# Altium project Current_Sensing.PrjPcb
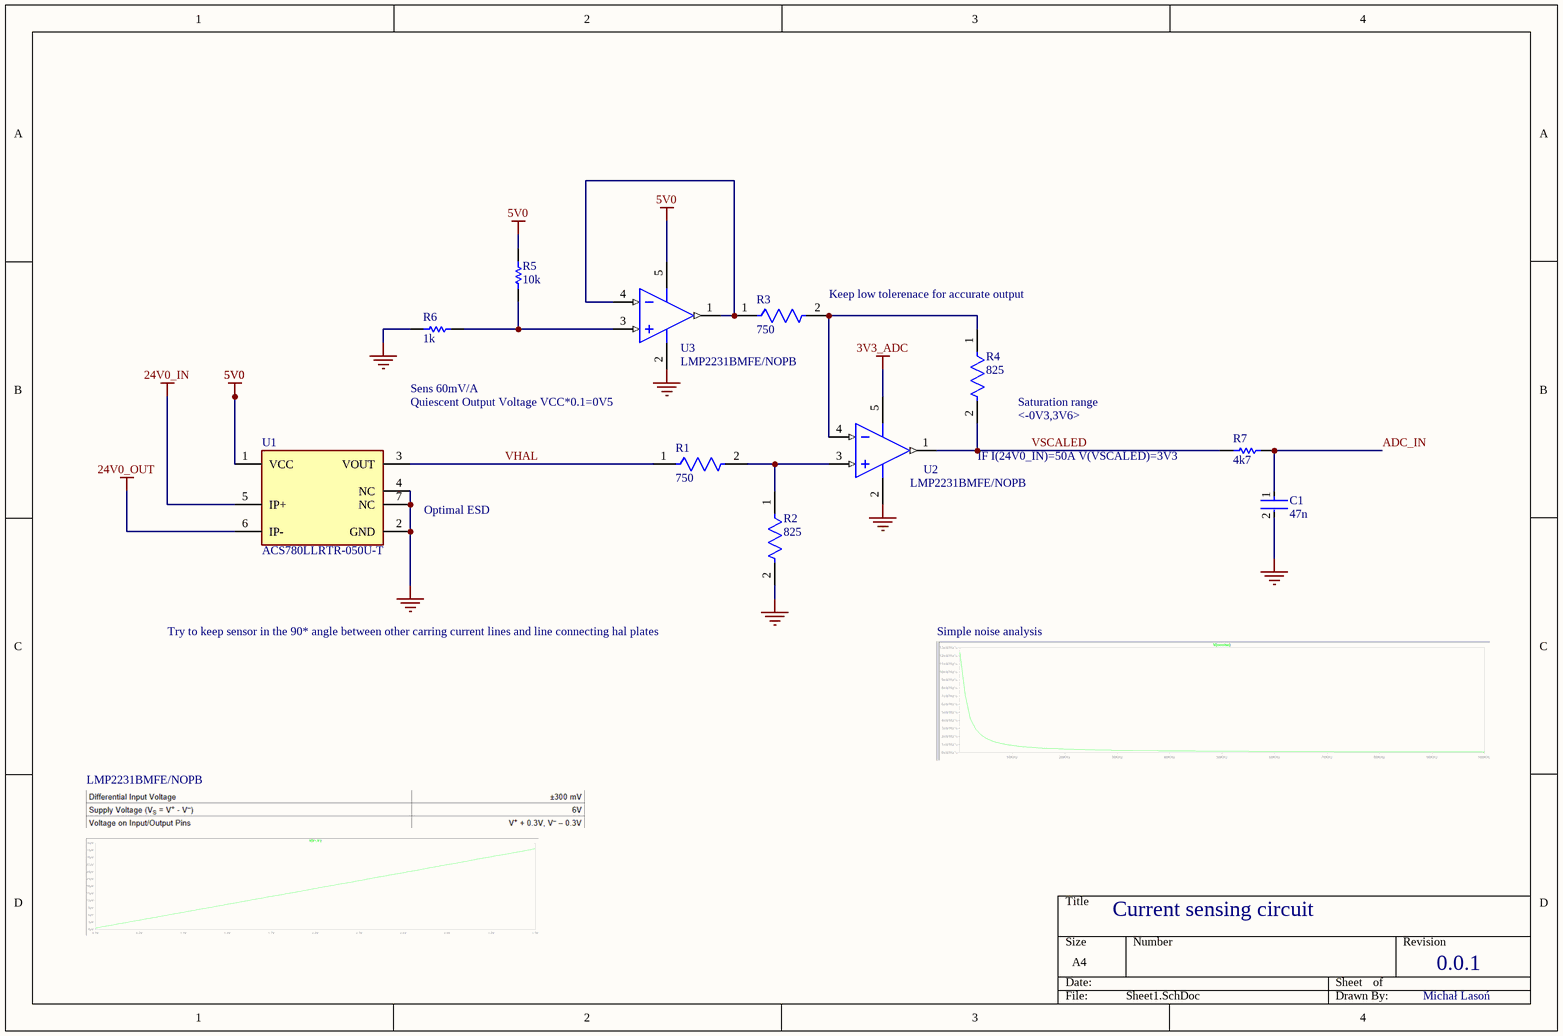
[diagram p0: Sheet1.SchDoc]
1 sheet, 11 parts. Net scope: global (net labels, ports and power ports of the same name join across sheets).

## Sheet Sheet1.SchDoc
size A4; SheetNumber: 1; SheetTotal: 1

### Parts
C1  47n  [FP-0805-L_2_01_0_2-W_1_25-MFG]
R1  750  [FP-RP73P-1J-MFG]
R2  825  [FP-RP73P-1J-MFG]
R3  750  [FP-RP73P-1J-MFG]
R4  825  [FP-RP73P-1J-MFG]
R5  10k  [RESC1609X50X30NL8T20]
R6  1k  [RESC1608X55X30LL15T15]
R7  4k7  [YAGO-RC0805_M]
U1  ACS780LLRTR-050U-T  [FP-LR-7-MFG]
U2  LMP2231BMFE/NOPB  [DBV0005A_L]
U3  LMP2231BMFE/NOPB  [DBV0005A_L]

### Nets
3V3_ADC: U2.5(V+)
5V0: R5.2 U1.1(VCC) U3.5(V+)
24V0_IN: U1.5(IP+)
24V0_OUT: U1.6(IP-)
GND: C1.2 R2.2 R6.1 U1.2(GND) U1.4(NC) U1.7(NC) U2.2(V-) U3.2(V-)
ADC_IN: C1.1 R7.2
VHAL: R1.1 U1.3(VOUT)
VSCALED: R4.2 R7.1 U2.1(OUT)
NetR1_2: R1.2 R2.1 U2.3(IN+)
NetR3_1: R3.1 U3.1(OUT) U3.4(IN-)
NetR3_2: R3.2 R4.1 U2.4(IN-)
NetR5_1: R5.1 R6.2 U3.3(IN+)

### Notes on the sheet
- (near R3) Keep low tolerenace for accurate output
- Sens 60mV/A
- Quiescent Output Voltage VCC*0.1=0V5
- (near R4) <-0V3,3V6>
- (near R4) Saturation range
- (near U1) Optimal ESD
- IF I(24V0_IN)=50A V(VSCALED)=3V3
- Try to keep sensor in the 90* angle between other carring current lines and line connecting hal plates
- Simple noise analysis
- LMP2231BMFE/NOPB
- Current sensing circuit
- 0.0.1
- Michał Lasoń

### Library data of the parts
C1 = CMP-04427-003357-1: General Purpose Ceramic Capacitor, 0805, 47nF, 10%, X8R, 15%, 50V; Case/Package: 0805; Voltage Rating (DC): 50V; Min Operating Temperature: -55°C; Number of Pins: 2; Depth: 1.25mm; Case Code (Imperial): 0805; Case Code (Metric): 2012; Voltage: 50V; Tolerance: 10%; Construction: Flat; Voltage Rating: 50V; REACH SVHC: No SVHC; Dielectric: X8R; Radiation Hardening: No; Dielectric Material: Ceramic; RoHS Compliant: Yes; Max Operating Temperature: 150°C; Length: 2.01mm; Height: 0.94mm; Packaging: Tape and Reel; Mount: Surface Mount; Termination: SMD/SMT; Capacitance: 47nF; Series: FlEXITERM
R1 R3 = CMP-03211-006713-1: RES SMD 750 OHM 0.1% 1/6W 0603; Manufacturer Part Number: RP73PF1J750RBTDF; Manufacturer: TE Connectivity; Value: 750Ω; Power Rating: 0.166W; Tolerance: 0.001; Temperature Coefficient: 25ppm/°C; Voltage Rating: 100V; Automotive: No; Height: 0.55mm; ComponentLink2URL: https://www.te.com/commerce/DocumentDelivery/DDEController?Action=srchrtrv&DocNm=1773272&DocType=DS&DocLang=English; Lead Free: Yes; RoHS: TRUE; Device Class L3: Chip SMD Resistors; Package: RP73P-1J; Temperature: -55°C to +155°C; Temperature Range Low: -55°C; Series: RP73P; Device Class L1: Passive Components; Category: Res; ComponentLink2Description: Datasheet; Composition: Thin Film; Temperature Range High: +155°C; Device Class L2: Resistors; Digikey Description: RES SMD 750 OHM 0.1% 1/6W 0603; Ipc Land Pattern Name: RESC15580X45; Resistance: 750Ω; Octopart: https://octopart.com/rp73pf1j750rbtdf-te+connectivity-45466235
R2 R4 = CMP-03211-002886-1: RES SMD 825 OHM 0.1% 1/6W 0603; Manufacturer: TE Connectivity; Manufacturer Part Number: RP73PF1J825RBTDF; Value: 825Ω; Power Rating: 0.166W; Voltage Rating: 100V; Temperature Coefficient: 25ppm/°C; Tolerance: 0.001; Lead Free: Yes; Package: RP73P-1J; Automotive: No; Category: Res; Composition: Thin Film; Digikey Description: RES SMD 825 OHM 0.1% 1/6W 0603; Ipc Land Pattern Name: RESC15580X45; RoHS: TRUE; Octopart: https://octopart.com/rp73pf1j825rbtdf-te+connectivity-45466269; Height: 0.55mm; Series: RP73P; Temperature Range Low: -55°C; Device Class L2: Resistors; Temperature: -55°C to +155°C; ComponentLink2URL: https://www.te.com/commerce/DocumentDelivery/DDEController?Action=srchrtrv&DocNm=1773272&DocType=DS&DocLang=English; Resistance: 825Ω; Device Class L1: Passive Components; Temperature Range High: +155°C; ComponentLink2Description: Datasheet; Device Class L3: Chip SMD Resistors
R5 = CMP-1666-00005-4: Chip Resistor, 10 KOhm, +/- 1%, 100 mW, -55 to 155 degC, 0603 (1608 Metric), RoHS, Tape and Reel; Manufacturer: Vishay Semiconductor; Voltage Rating: 75 V; Max Operating Temperature: 155 degC; PackageDescription: 2-Pin Surface Mount Device, Body 1.575 x 0.85 mm; ComponentLink1Description: Manufacturer URL; RoHSCompliant: true; PackageReference: 0603; REACH SVHC: Unknown; Length: 1.55 mm; DatasheetVersion: 06/2012; Packaging: Tape and Reel; Min Operating Temperature: -55 degC; Mounting Technology: Surface Mount; ComponentLink2URL: https://datasheet.ciiva.com/11809/0900766b80d98afc-11809037.pdf; Height: 0.45 mm; ComponentLink2Description: Datasheet; Package Quantity: 5000; ComponentLink1URL: http://www.vishay.com/
R6 = CMP-2000-00180-1: Part Number: ERJ-3EKF1001V; Manufacturer: Panasonic
R7 = CMP-1568-00001-1: General Puprose Chip Resistor, 4700 Ohm +/- 1%, 0.125 W, -55 to 155 degC, 2-Pin SMD, RoHS, Tape and Reel; PartNumber: RC0805FR-074K7L; Tolerance: +/- 1%; Power: 0.125 W; PackageDescription: 2-Pin Surface Mount Device, Body 2 x 1.25 mm; ComponentLink2URL: http://www.yageo.com/documents/recent/PYu-RC_Group_51_RoHS_L-3.pdf; Temperature Min: -55 degC; Packing: Tape and Reel; Mounting Technology: Surface Mount; ComponentLink1URL: http://www.yageo.com/NewPortal/_en/index.jsp; Resistance: 4700 Ohm; Temperature Max: 155 degC; ComponentLink2Description: Datasheet; DatasheetVersion: Rev. 3; RoHS: TRUE; ComponentLink1Description: Manufacturer URL
U1 = CMP-82923-000229-1: HIGH-PRECISION LINEAR HALL-EFFEC; Frequency: 120kHz; Accuracy: 1.5%; Max Supply Current: 15mA; Current Sensing: 50A; Number of Channels: 1; Polarity: Unidirectional; Sensitivity: 60mV/A; Linearity: 1%; Response Time: 3.6us; Packaging: Tape and Reel; RoHS Compliant: Yes; Max Operating Temperature: 150°C; Mount: Surface Mount; Min Operating Temperature: -40°C
U2 U3 = CMP-0055-01219-3: Single Micropower, 1.6V, Precision Operational Amplifier with CMOS Inputs, 5-pin SOT-23, Pb-Free; Manufacturer: Texas Instruments; PowerWise: N; CompType: Amplifiers; PackageTopMarking: AL5B*XTT; RoHS: Y; PackageDescription: Molded SOT-23, .115 x .063 x .040 in Body, 5 Lead, .0375 in Pitch; PinCount: 5; ComponentLink1Description: Datasheet URL; Package Reference: DBV0005A; ComponentLink1URL: http://www.ti.com/general/docs/lit/getliterature.tsp?genericPartNumber=LMP2231&fileType=pdf